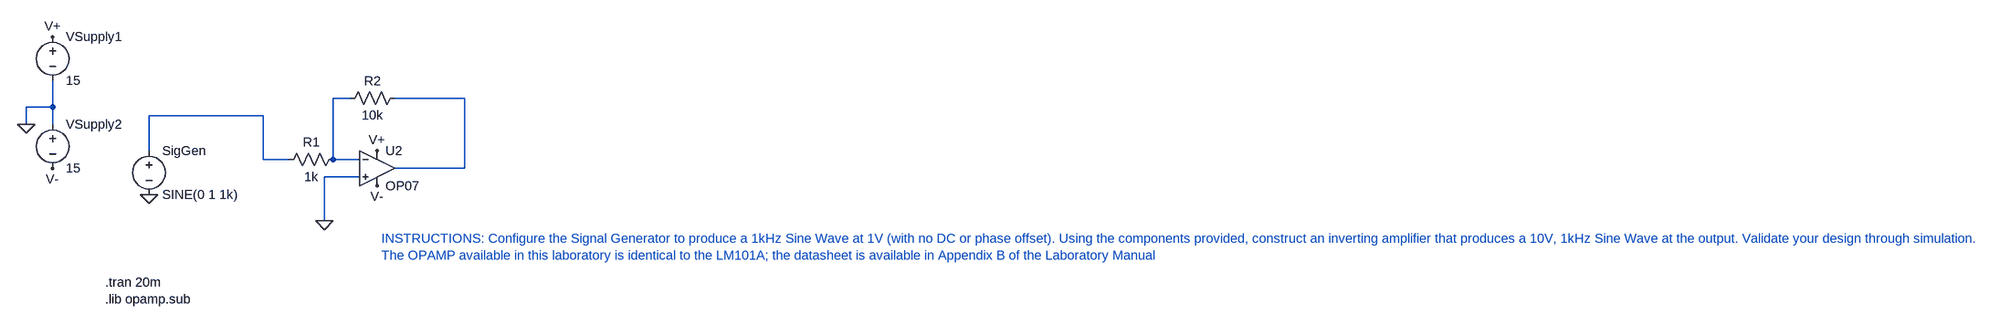
[diagram p0: schematic OpAmp.asc]
OpAmp.asc, the LTspice schematic file:
Version 4
SHEET 1 3344 680
WIRE 32 16 0 16
WIRE 240 16 112 16
WIRE -512 32 -512 -16
WIRE -512 32 -560 32
WIRE -128 48 -336 48
WIRE -560 64 -560 32
WIRE -512 64 -512 32
WIRE -336 112 -336 48
WIRE -128 128 -128 48
WIRE -80 128 -128 128
WIRE 0 128 0 16
WIRE 48 128 0 128
WIRE 240 144 240 16
WIRE 240 144 112 144
WIRE 48 160 -16 160
WIRE -16 240 -16 160
FLAG -16 240 0
FLAG 80 112 V+
FLAG 80 176 V-
FLAG -336 192 0
FLAG -560 64 0
FLAG -512 144 V-
FLAG -512 -96 V+
SYMBOL voltage -336 96 R0
SYMATTR InstName SigGen
SYMATTR Value SINE(0 1 1k)
SYMBOL res 16 112 R90
WINDOW 0 0 56 VBottom 2
WINDOW 3 32 56 VTop 2
SYMATTR InstName R1
SYMATTR Value 1k
SYMBOL res 128 0 R90
WINDOW 0 0 56 VBottom 2
WINDOW 3 32 56 VTop 2
SYMATTR InstName R2
SYMATTR Value 10k
SYMBOL voltage -512 -112 R0
SYMATTR InstName VSupply1
SYMATTR Value 15
SYMBOL voltage -512 48 R0
SYMATTR InstName VSupply2
SYMATTR Value 15
SYMBOL OpAmps/OP07 80 80 R0
SYMATTR InstName U2
TEXT -416 352 Left 2 !.tran 20m\n.lib opamp.sub
TEXT 88 272 Left 2 ;INSTRUCTIONS: Configure the Signal Generator to produce a 1kHz Sine Wave at 1V (with no DC or phase offset). Using the components provided, construct an inverting amplifier that produces a 10V, 1kHz Sine Wave at the output. Validate your design through simulation.\nThe OPAMP available in this laboratory is identical to the LM101A; the datasheet is available in Appendix B of the Laboratory Manual

The netlist it stands for:
* OpAmp.asc
V§SigGen N003 0 SINE(0 1 1k)
R1 N001 N003 1k
R2 N002 N001 10k
VSupply1 V+ 0 15
VSupply2 0 V- 15
XU2 0 N001 V+ V- N002 LT1001  ; OP07, pins In+ In- V+ V- OUT
.tran 20m
.lib opamp.sub
* INSTRUCTIONS: Configure the Signal Generator to produce a 1kHz Sine Wave at 1V (with no DC or phase offset). Using the components provided, construct an inverting amplifier that produces a 10V, 1kHz Sine Wave at the output. Validate your design through simulation.
* The OPAMP available in this laboratory is identical to the LM101A; the datasheet is available in Appendix B of the Laboratory Manual
.lib LTC.lib
.backanno
.end